# Altium schematic sheet Power.SchDoc
size A
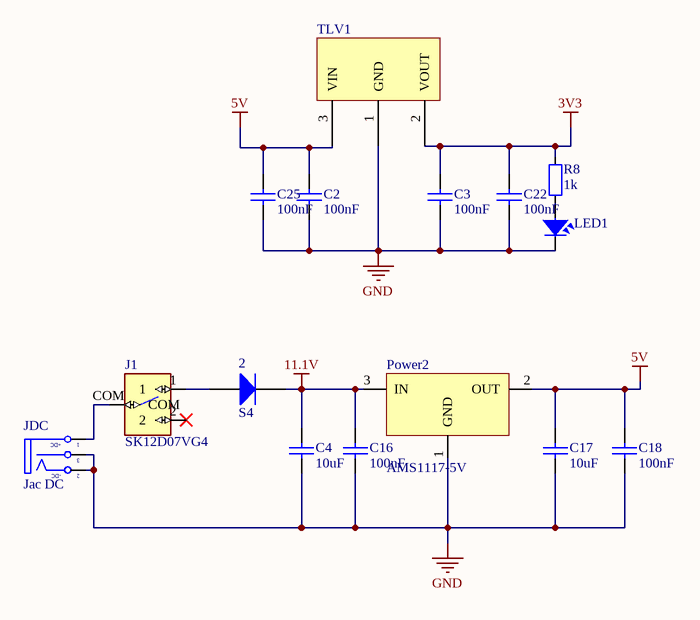
[diagram p0: Power.SchDoc]

## Parts
2  S4  [DIO-214AC(SMA)]
C2  100nF  [CAP_0805]
C3  100nF  [CAP_0805]
C4  10uF  [CAP_0805]
C16  100nF  [CAP_0805]
C17  10uF  [CAP_0805]
C18  100nF  [CAP_0805]
C22  100nF  [CAP_0805]
C25  100nF  [CAP_0805]
J1  SK12D07VG4  [SK12D07VG4]
JDC  Jac DC  [DC-IN]
LED1  LED  [LED-0805-Blue]  (value not drawn)
Power2  AMS1117-5V  [SOT223]
R8  1k  [RES-SMD-0805]
TLV1  LM1117- 5V  [SOT230P700X180-4N]  (value not drawn)

## Nets
3V3: C3.1 C22.1 R8.1 TLV1.2(VOUT)
5V: C2.1 C17.1 C18.1 C25.1 Power2.2(OUT) TLV1.3(VIN)
11.1V: 2.2(K) C4.1 C16.1 Power2.3(IN)
GND: C2.2 C3.2 C4.2 C16.2 C17.2 C18.2 C22.2 C25.2 JDC.2(TN) JDC.3(S) LED1.2 Power2.1(GND) TLV1.1(GND)
Net2_1: 2.1(A) J1.1
NetJ1_COM: J1.COM JDC.1(T)
NetLED1_1: LED1.1 R8.2

Not connected (* = marked no-connect by the designer): J1 2*

## Notes on the sheet
- (in symbol DCIN) +DC; -DC

## Library data of the parts
2 = Diode S4: Dán; Ten_Linh_Kien: Diode S4 SOD123 ( 1N5819 SOD123); Ma_Hang: MH005519; Don_Vi: Con; Ghi_Chu: *; Chung_Loai: Dán; Kieu_Chan: *
C2-C4 C16-C18 C22 C25 = CapSMD: Capacitor; Value: 33p; Published: 8-Jun-2000; LatestRevisionDate: 17-Jul-2002; LatestRevisionNote: Re-released for DXP Platform.; PackageReference: RAD-0.3; Publisher: Altium Limited
J1 = SK12D07VG4: Switch Slide ON ON SPDT Side Slide 0.3A 30VDC PC Pins Bracket Mount/Through Hole Bulk; MF: C&K; Price: None; Check_prices: https://www.snapeda.com/parts/SK12D07VG4/C&K/view-part/6618061/?ref=eda; SnapEDA_Link: https://www.snapeda.com/parts/SK12D07VG4/C&K/view-part/6618061/?ref=snap; Package: None; Availability: Not in stock; MP: SK12D07VG4; Value: *
JDC = DCIN: Jac DC input; Value: Jac DC
LED1 = LED: LED Single colour Green and Red; Value: LED 3 ly Single Colour
Power2 = LM1117: 800mA Low-Dropout Linear Regulator; Creator: Nguyen Ba Bien; Website: http://group3i.net
R8 = Resistor - SMD: Resistor; Manufacturer: Generic Components; Class: Passive; Published: 08/06/2000; Publisher: Altium Hobart Technology Centre
TLV1 = LM1117